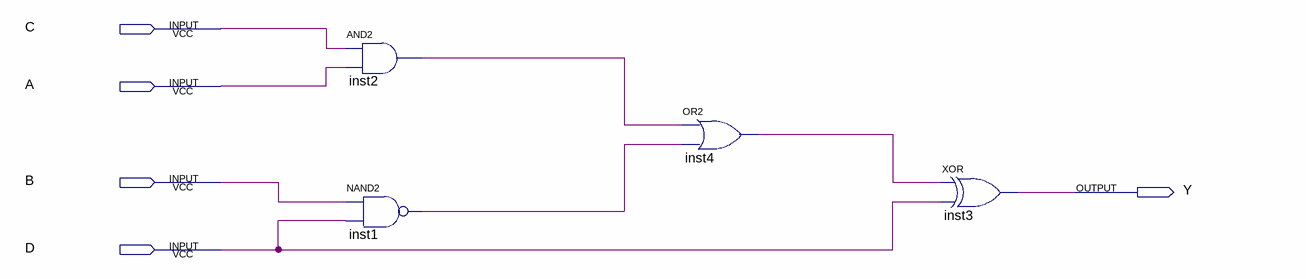
[diagram p0: schematic sheet]
// Quartus schematic lab11.bdf as structural Verilog: 4 symbols, 5 pins
module lab11 (
  input  C,
  input  A,
  input  B,
  input  D,
  output Y
);

  wire inst1_out, inst2_out, inst4_out;

  and inst2 (inst2_out, C, A);
  nand inst1 (inst1_out, B, D);
  or inst4 (inst4_out, inst2_out, inst1_out);
  xor inst3 (Y, inst4_out, D);
endmodule
